# EAGLE schematic Microcell 1.4 (EAGLE 9.4.2)

## Sheet 1 of 5: PTH
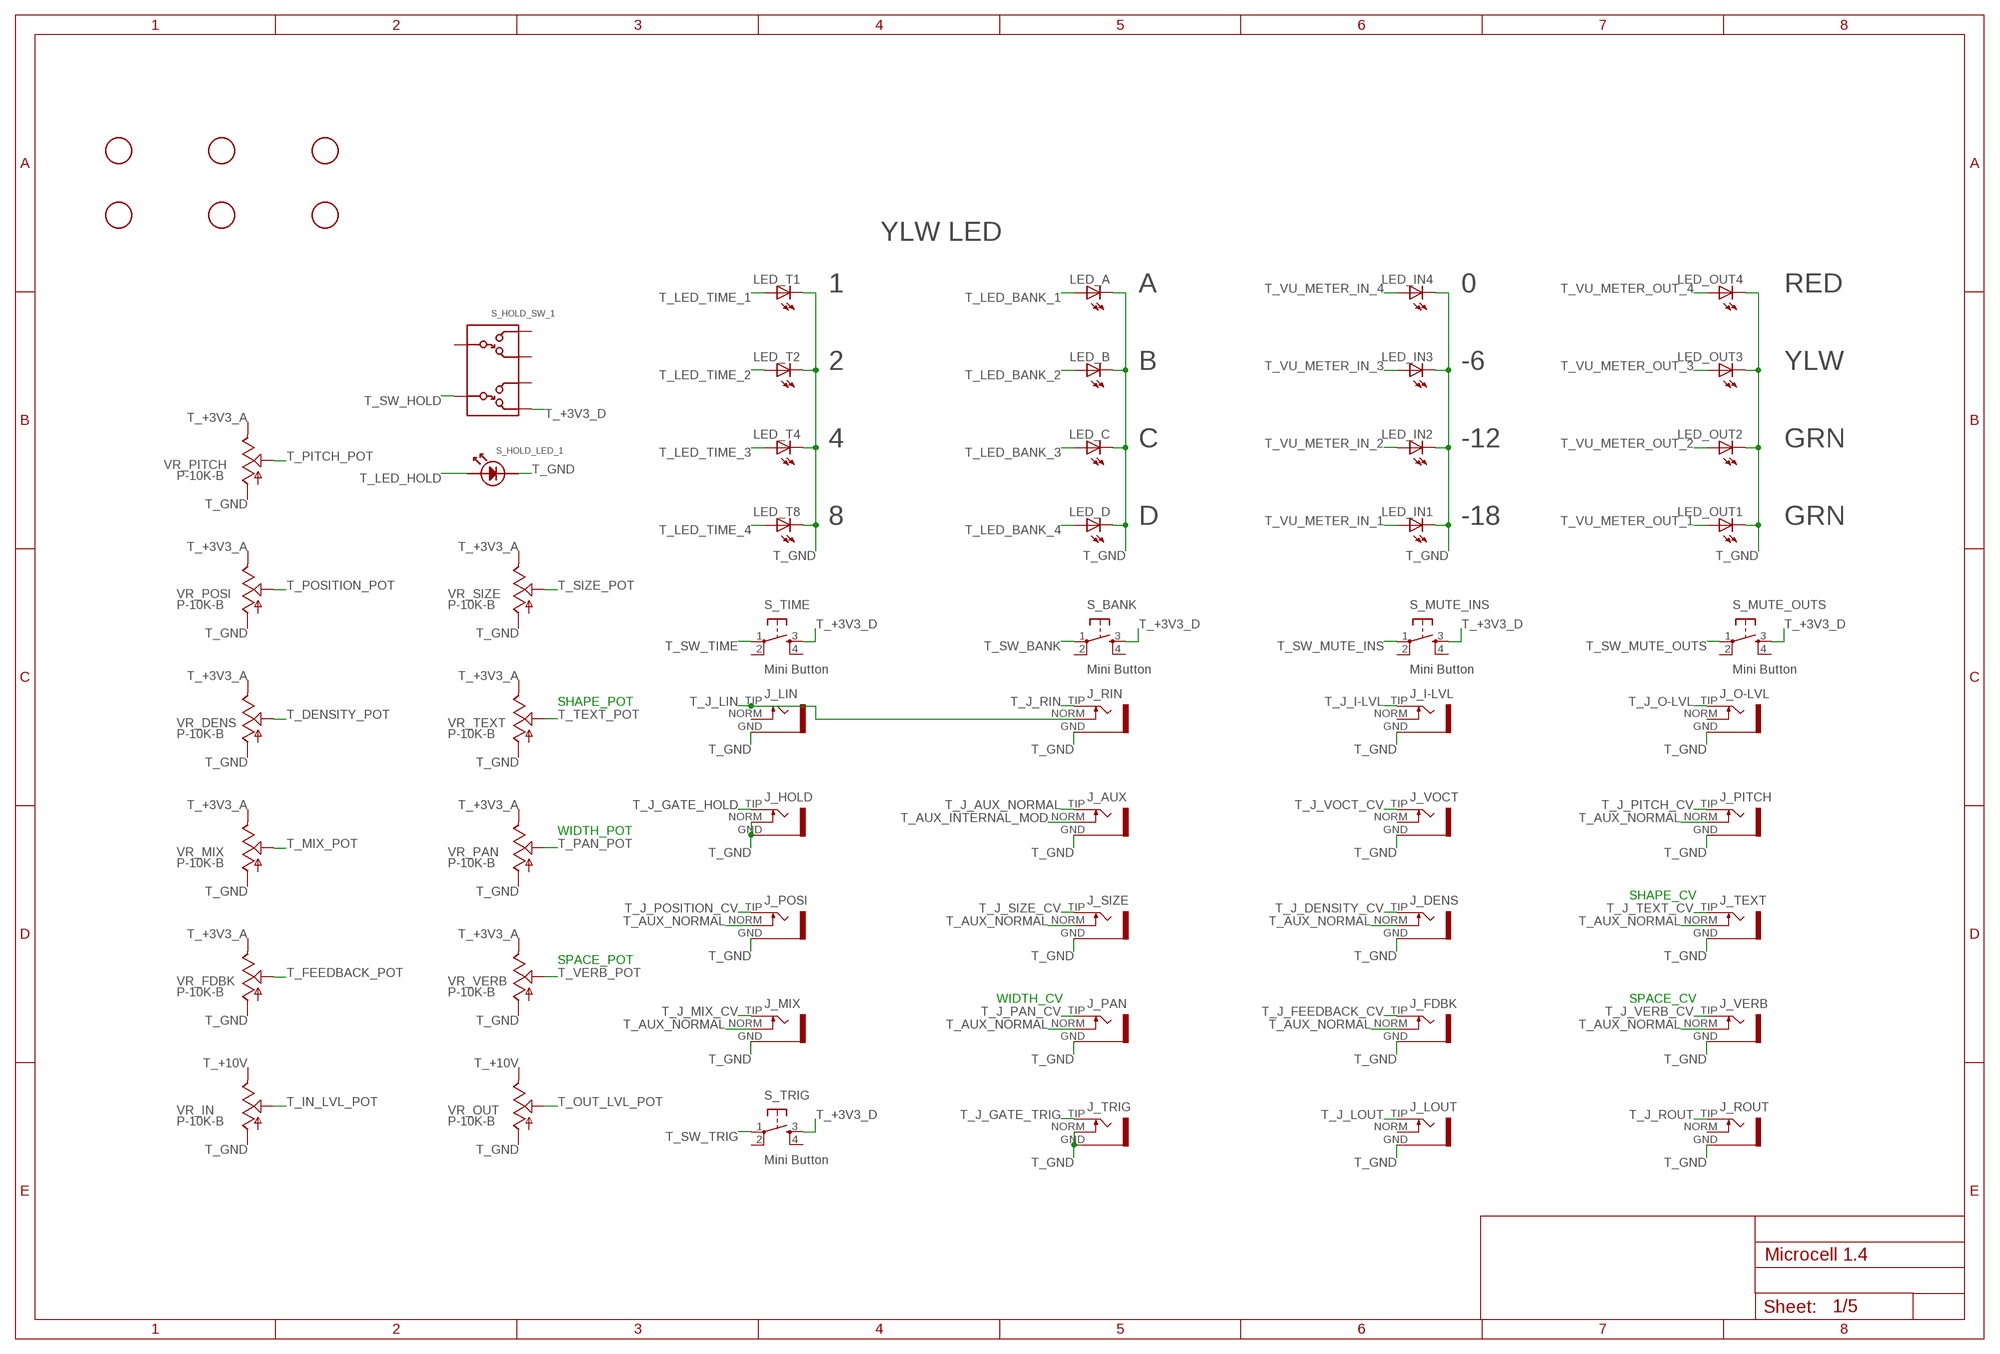
[diagram p0: schematic, sheet 1]

### Parts
FD1  FIDUCIAL  [FIDUCIAL_1MM]
FD2  FIDUCIAL  [FIDUCIAL_1MM]
FD3  FIDUCIAL  [FIDUCIAL_1MM]
FD4  FIDUCIAL  [FIDUCIAL_1MM]
FD5  FIDUCIAL  [FIDUCIAL_1MM]
FD6  FIDUCIAL  [FIDUCIAL_1MM]
J_AUX  Eurorack Jack  EURO_JACKS_SMALL_SILK  [S_JACK_SMALL_SILK]
J_DENS  Eurorack Jack  EURO_JACKS_SILK  [S_JACK_SILK]
J_FDBK  Eurorack Jack  EURO_JACKS_SILK  [S_JACK_SILK]
J_HOLD  Eurorack Jack  EURO_JACKS_SMALL_SILK  [S_JACK_SMALL_SILK]
J_I-LVL  Eurorack Jack  EURO_JACKS_SILK  [S_JACK_SILK]
J_LIN  Eurorack Jack  EURO_JACKS_SILK  [S_JACK_SILK]
J_LOUT  Eurorack Jack  EURO_JACKS_SILK  [S_JACK_SILK]
J_MIX  Eurorack Jack  EURO_JACKS_SILK  [S_JACK_SILK]
J_O-LVL  Eurorack Jack  EURO_JACKS_SILK  [S_JACK_SILK]
J_PAN  Eurorack Jack  EURO_JACKS_SILK  [S_JACK_SILK]
J_PITCH  Eurorack Jack  EURO_JACKS_SILK  [S_JACK_SILK]
J_POSI  Eurorack Jack  EURO_JACKS_SILK  [S_JACK_SILK]
J_RIN  Eurorack Jack  EURO_JACKS_SILK  [S_JACK_SILK]
J_ROUT  Eurorack Jack  EURO_JACKS_SILK  [S_JACK_SILK]
J_SIZE  Eurorack Jack  EURO_JACKS_SILK  [S_JACK_SILK]
J_TEXT  Eurorack Jack  EURO_JACKS_SILK  [S_JACK_SILK]
J_TRIG  Eurorack Jack  EURO_JACKS_SMALL_SILK  [S_JACK_SMALL_SILK]
J_VERB  Eurorack Jack  EURO_JACKS_SILK  [S_JACK_SILK]
J_VOCT  Eurorack Jack  EURO_JACKS_SILK  [S_JACK_SILK]
LED_A  3mm Yellow Diffused  LED_SILK  [LED_SILK]
LED_B  3mm Yellow Diffused  LED_SILK  [LED_SILK]
LED_C  3mm Yellow Diffused  LED_SILK  [LED_SILK]
LED_D  3mm Yellow Diffused  LED_SILK  [LED_SILK]
LED_IN1  3mm Green Diffused  LED_SILK  [LED_SILK]
LED_IN2  3mm Green Diffused  LED_SILK  [LED_SILK]
LED_IN3  3mm Yellow Diffused  LED_SILK  [LED_SILK]
LED_IN4  3mm Red Diffused  LED_SILK  [LED_SILK]
LED_OUT1  3mm Green Diffused  LED_SILK  [LED_SILK]
LED_OUT2  3mm Green Diffused  LED_SILK  [LED_SILK]
LED_OUT3  3mm Yellow Diffused  LED_SILK  [LED_SILK]
LED_OUT4  3mm Red Diffused  LED_SILK  [LED_SILK]
LED_T1  3mm Yellow Diffused  LED_SILK  [LED_SILK]
LED_T2  3mm Yellow Diffused  LED_SILK  [LED_SILK]
LED_T4  3mm Yellow Diffused  LED_SILK  [LED_SILK]
LED_T8  3mm Yellow Diffused  LED_SILK  [LED_SILK]
S_BANK  Mini Button  TAC_SWITCHTACTILE_PTH_SILK  [TACTILE-PTH_SILK]
S_HOLD  LED Button White  LED_BUTTONLED_BUTTON_SILK  [LED_BUTTON_SILK]
S_MUTE_INS  Mini Button  TAC_SWITCHTACTILE_PTH_SILK  [TACTILE-PTH_SILK]
S_MUTE_OUTS  Mini Button  TAC_SWITCHTACTILE_PTH_SILK  [TACTILE-PTH_SILK]
S_TIME  Mini Button  TAC_SWITCHTACTILE_PTH_SILK  [TACTILE-PTH_SILK]
S_TRIG  Mini Button  TAC_SWITCHTACTILE_PTH_SILK  [TACTILE-PTH_SILK]
VR_DENS  P-10K-B  POT_9MM_SNAP-IN__  [9MM_SNAP-IN_POT_SILK]
VR_FDBK  P-10K-B  POT_9MM_SNAP-IN__  [9MM_SNAP-IN_POT_SILK]
VR_IN  P-10K-B  POT_9MM_SNAP-IN__  [9MM_SNAP-IN_POT_SILK]
VR_MIX  P-10K-B  POT_9MM_SNAP-IN__  [9MM_SNAP-IN_POT_SILK]
VR_OUT  P-10K-B  POT_9MM_SNAP-IN__  [9MM_SNAP-IN_POT_SILK]
VR_PAN  P-10K-B  POT_9MM_SNAP-IN__  [9MM_SNAP-IN_POT_SILK]
VR_PITCH  P-10K-B  POT_9MM_SNAP-IN__  [9MM_SNAP-IN_POT_SILK]
VR_POSI  P-10K-B  POT_9MM_SNAP-IN__  [9MM_SNAP-IN_POT_SILK]
VR_SIZE  P-10K-B  POT_9MM_SNAP-IN__  [9MM_SNAP-IN_POT_SILK]
VR_TEXT  P-10K-B  POT_9MM_SNAP-IN__  [9MM_SNAP-IN_POT_SILK]
VR_VERB  P-10K-B  POT_9MM_SNAP-IN__  [9MM_SNAP-IN_POT_SILK]

### Nets
T_+3V3_A: VR_DENS.3 VR_FDBK.3 VR_MIX.3 VR_PAN.3 VR_PITCH.3 VR_POSI.3 VR_SIZE.3 VR_TEXT.3 VR_VERB.3 ; also sheet 2
T_+3V3_D: S_BANK.3 S_HOLD.3 S_MUTE_INS.3 S_MUTE_OUTS.3 S_TIME.3 S_TRIG.3 ; also sheet 2
T_+10V: VR_IN.3 VR_OUT.3 ; also sheet 2
T_AUX_INTERNAL_MOD: J_AUX.NORM ; also sheet 2
T_AUX_NORMAL: J_DENS.NORM J_FDBK.NORM J_MIX.NORM J_PAN.NORM J_PITCH.NORM J_POSI.NORM J_SIZE.NORM J_TEXT.NORM J_VERB.NORM ; also sheet 2
T_DENSITY_POT: VR_DENS.2 ; also sheet 2
T_FEEDBACK_POT: VR_FDBK.2 ; also sheet 2
T_GND: J_AUX.GND J_DENS.GND J_FDBK.GND J_HOLD.GND J_HOLD.NORM J_I-LVL.GND J_LIN.GND J_LOUT.GND J_MIX.GND J_O-LVL.GND J_PAN.GND J_PITCH.GND J_POSI.GND J_RIN.GND J_ROUT.GND J_SIZE.GND J_TEXT.GND J_TRIG.GND J_TRIG.NORM J_VERB.GND J_VOCT.GND LED_A.K(C) LED_B.K(C) LED_C.K(C) LED_D.K(C) LED_IN1.K(C) LED_IN2.K(C) LED_IN3.K(C) LED_IN4.K(C) LED_OUT1.K(C) LED_OUT2.K(C) LED_OUT3.K(C) LED_OUT4.K(C) LED_T1.K(C) LED_T2.K(C) LED_T4.K(C) LED_T8.K(C) S_HOLD.LED_K(_LED_1:LED_K) VR_DENS.1 VR_FDBK.1 VR_IN.1 VR_MIX.1 VR_OUT.1 VR_PAN.1 VR_PITCH.1 VR_POSI.1 VR_SIZE.1 VR_TEXT.1 VR_VERB.1 ; also sheet 2
T_IN_LVL_POT: VR_IN.2 ; also sheet 2
T_J_AUX_NORMAL: J_AUX.TIP ; also sheet 2
T_J_DENSITY_CV: J_DENS.TIP ; also sheet 2
T_J_FEEDBACK_CV: J_FDBK.TIP ; also sheet 2
T_J_GATE_HOLD: J_HOLD.TIP ; also sheet 2
T_J_GATE_TRIG: J_TRIG.TIP ; also sheet 2
T_J_I-LVL: J_I-LVL.TIP ; also sheet 2
T_J_LIN: J_LIN.TIP J_RIN.NORM ; also sheet 2
T_J_LOUT: J_LOUT.TIP ; also sheet 2
T_J_MIX_CV: J_MIX.TIP ; also sheet 2
T_J_O-LVL: J_O-LVL.TIP ; also sheet 2
T_J_PAN_CV: J_PAN.TIP ; also sheet 2
T_J_PITCH_CV: J_PITCH.TIP ; also sheet 2
T_J_POSITION_CV: J_POSI.TIP ; also sheet 2
T_J_RIN: J_RIN.TIP ; also sheet 2
T_J_ROUT: J_ROUT.TIP ; also sheet 2
T_J_SIZE_CV: J_SIZE.TIP ; also sheet 2
T_J_TEXT_CV: J_TEXT.TIP ; also sheet 2
T_J_VERB_CV: J_VERB.TIP ; also sheet 2
T_J_VOCT_CV: J_VOCT.TIP ; also sheet 2
T_LED_BANK_1: LED_A.A ; also sheet 2
T_LED_BANK_2: LED_B.A ; also sheet 2
T_LED_BANK_3: LED_C.A ; also sheet 2
T_LED_BANK_4: LED_D.A ; also sheet 2
T_LED_HOLD: S_HOLD.LED_A(_LED_1:LED_A) ; also sheet 2
T_LED_TIME_1: LED_T1.A ; also sheet 2
T_LED_TIME_2: LED_T2.A ; also sheet 2
T_LED_TIME_3: LED_T4.A ; also sheet 2
T_LED_TIME_4: LED_T8.A ; also sheet 2
T_MIX_POT: VR_MIX.2 ; also sheet 2
T_OUT_LVL_POT: VR_OUT.2 ; also sheet 2
T_PAN_POT: VR_PAN.2 ; also sheet 2
T_PITCH_POT: VR_PITCH.2 ; also sheet 2
T_POSITION_POT: VR_POSI.2 ; also sheet 2
T_SIZE_POT: VR_SIZE.2 ; also sheet 2
T_SW_BANK: S_BANK.1 ; also sheet 2
T_SW_HOLD: S_HOLD.2 ; also sheet 2
T_SW_MUTE_INS: S_MUTE_INS.1 ; also sheet 2
T_SW_MUTE_OUTS: S_MUTE_OUTS.1 ; also sheet 2
T_SW_TIME: S_TIME.1 ; also sheet 2
T_SW_TRIG: S_TRIG.1 ; also sheet 2
T_TEXT_POT: VR_TEXT.2 ; also sheet 2
T_VERB_POT: VR_VERB.2 ; also sheet 2
T_VU_METER_IN_1: LED_IN1.A ; also sheet 2
T_VU_METER_IN_2: LED_IN2.A ; also sheet 2
T_VU_METER_IN_3: LED_IN3.A ; also sheet 2
T_VU_METER_IN_4: LED_IN4.A ; also sheet 2
T_VU_METER_OUT_1: LED_OUT1.A ; also sheet 2
T_VU_METER_OUT_2: LED_OUT2.A ; also sheet 2
T_VU_METER_OUT_3: LED_OUT3.A ; also sheet 2
T_VU_METER_OUT_4: LED_OUT4.A ; also sheet 2
Unconnected: J_I-LVL.NORM J_LIN.NORM J_LOUT.NORM J_O-LVL.NORM J_ROUT.NORM J_VOCT.NORM S_BANK.2 S_BANK.4 S_HOLD.1 S_HOLD.4 S_HOLD.5 S_HOLD.6 S_MUTE_INS.2 S_MUTE_INS.4 S_MUTE_OUTS.2 S_MUTE_OUTS.4 S_TIME.2 S_TIME.4 S_TRIG.2 S_TRIG.4

### Notes on the sheet
- YLW LED
- 1 | A | 0 | RED
- 2 | B | -6 | YLW
- 4 | C | -12 | GRN
- 8 | D | -18 | GRN
- SHAPE_POT
- WIDTH_POT
- SHAPE_CV
- SPACE_POT
- WIDTH_CV | SPACE_CV

## Sheet 2 of 5: POWER
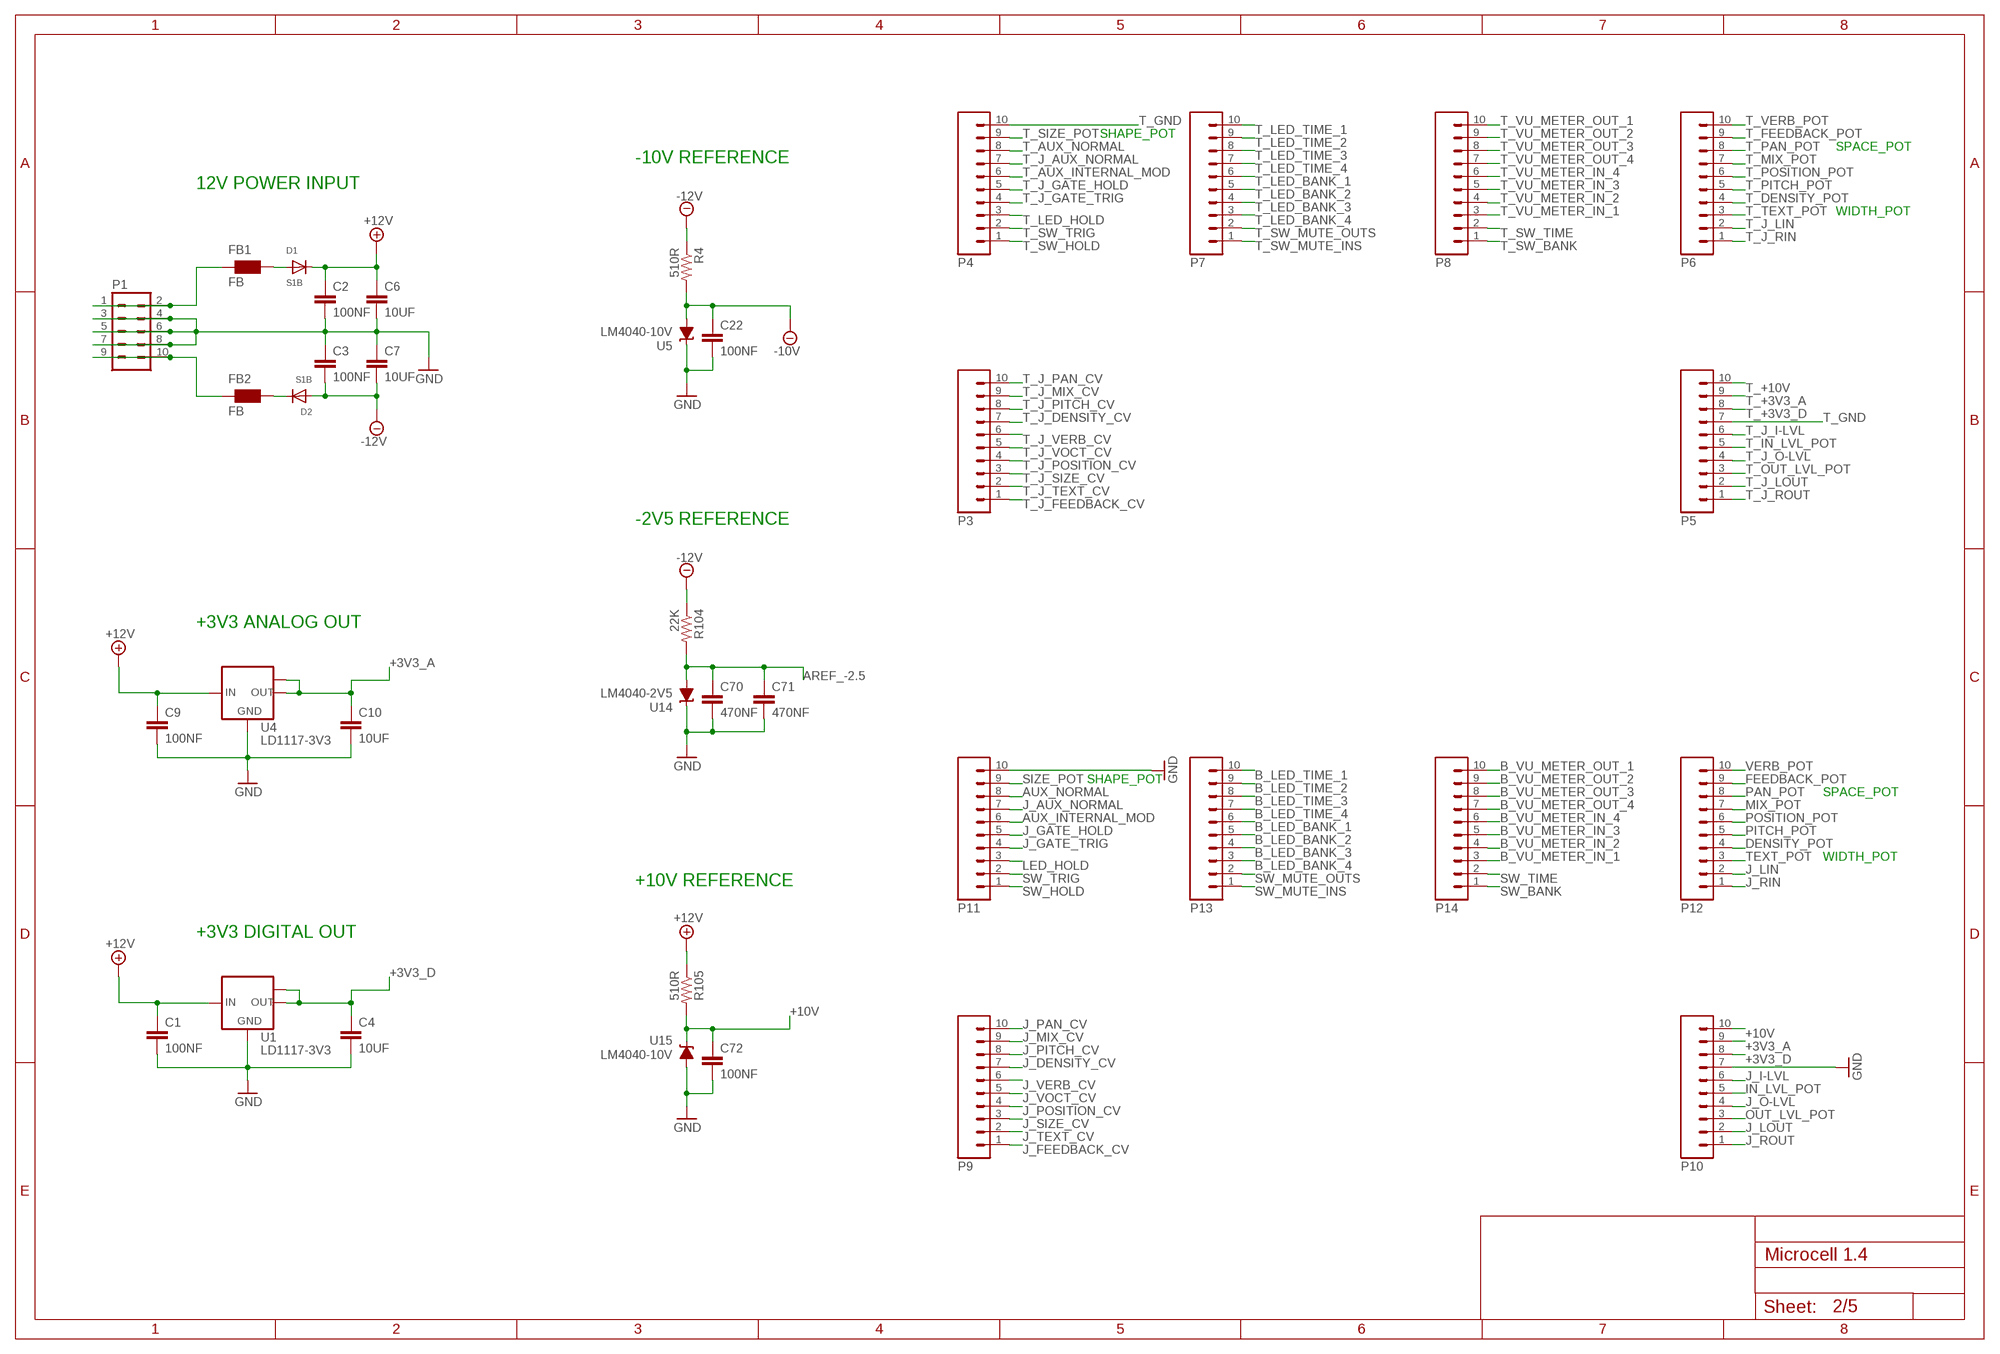
[diagram p1: schematic, sheet 2]

### Parts
C1  100NF  C-EUC0603  [C0603]
C2  100NF  C-EUC0603  [C0603]
C3  100NF  C-EUC0603  [C0603]
C4  10UF  C-EUC0805  [C0805]
C6  10UF  C-EUC0805  [C0805]
C7  10UF  C-EUC0805  [C0805]
C9  100NF  C-EUC0603  [C0603]
C10  10UF  C-EUC0805  [C0805]
C22  100NF  C-EUC0603  [C0603]
C70  470NF  C-EUC0603  [C0603]
C71  470NF  C-EUC0603  [C0603]
C72  100NF  C-EUC0603  [C0603]
D1  S1B  [SMADIODE]
D2  S1B  [SMADIODE]
FB1  FB  FERRITE_BEAD_0603  [WUERTH-ELEKTRONIK_0603]
FB2  FB  FERRITE_BEAD_0603  [WUERTH-ELEKTRONIK_0603]
P1  2X5 Male PTH Header  M05X2_LOCK  [2X5_LOCK]
P3  1X10 Female PTH header  M10_NO_SILK  [1X10_NO_SILK]
P4  1X10 Female PTH header  M10_NO_SILK  [1X10_NO_SILK]
P5  1X10 Female PTH header  M10_NO_SILK  [1X10_NO_SILK]
P6  1X10 Female PTH header  M10_NO_SILK  [1X10_NO_SILK]
P7  1X10 Female PTH header  M10_NO_SILK  [1X10_NO_SILK]
P8  1X10 Female PTH header  M10_NO_SILK  [1X10_NO_SILK]
P9  1X10 Male PTH header  M10_NO_SILK  [1X10_NO_SILK]
P10  1X10 Male PTH header  M10_NO_SILK  [1X10_NO_SILK]
P11  1X10 Male PTH header  M10_NO_SILK  [1X10_NO_SILK]
P12  1X10 Male PTH header  M10_NO_SILK  [1X10_NO_SILK]
P13  1X10 Male PTH header  M10_NO_SILK  [1X10_NO_SILK]
P14  1X10 Male PTH header  M10_NO_SILK  [1X10_NO_SILK]
R4  510R  R-US_R0603  [R0603]
R104  22K  R-US_R0603  [R0603]
R105  510R  R-US_R0603  [R0603]
U1  LD1117-3V3  [SOT223]
U4  LD1117-3V3  [SOT223]
U5  LM4040-10V  LM4041A12DBZ  [DBZ_R-PDSO-G3]
U14  LM4040-2V5  LM4041A12DBZ  [DBZ_R-PDSO-G3]
U15  LM4040-10V  LM4041A12DBZ  [DBZ_R-PDSO-G3]

### Nets
+3V3_A: C10.1 P10.9 U4.2(OUT) U4.TAB(OUT1) ; also sheet 4,5
+3V3_D: C4.1 P10.8 U1.2(OUT) U1.TAB(OUT1) ; also sheet 4,5
+10V: C72.1 P10.10 R105.2 U15.1(C)
+12V: C1.1 C2.1 C6.1 C9.1 D1.C R105.1 U1.3(IN) U4.3(IN) ; also sheet 3,4
-10V: C22.1 R4.2 U5.2(A) ; also sheet 4
-12V: C3.2 C7.2 D2.A R4.1 R104.1 ; also sheet 3,4
AREF_-2.5: C70.1 C71.1 R104.2 U14.2(A) ; also sheet 3
AUX_INTERNAL_MOD: P11.6 ; also sheet 4
AUX_NORMAL: P11.8 ; also sheet 4
B_LED_BANK_1: P13.6 ; also sheet 5
B_LED_BANK_2: P13.5 ; also sheet 5
B_LED_BANK_3: P13.4 ; also sheet 5
B_LED_BANK_4: P13.3 ; also sheet 5
B_LED_TIME_1: P13.10 ; also sheet 5
B_LED_TIME_2: P13.9 ; also sheet 5
B_LED_TIME_3: P13.8 ; also sheet 5
B_LED_TIME_4: P13.7 ; also sheet 5
B_VU_METER_IN_1: P14.3 ; also sheet 5
B_VU_METER_IN_2: P14.4 ; also sheet 5
B_VU_METER_IN_3: P14.5 ; also sheet 5
B_VU_METER_IN_4: P14.6 ; also sheet 5
B_VU_METER_OUT_1: P14.10 ; also sheet 5
B_VU_METER_OUT_2: P14.9 ; also sheet 5
B_VU_METER_OUT_3: P14.8 ; also sheet 5
B_VU_METER_OUT_4: P14.7 ; also sheet 5
DENSITY_POT: P12.4 ; also sheet 5
FEEDBACK_POT: P12.9 ; also sheet 5
GND: C1.2 C2.2 C3.1 C4.2 C6.2 C7.1 C9.2 C10.2 C22.2 C70.2 C71.2 C72.2 P1.3 P1.4 P1.5 P1.6 P1.7 P1.8 P10.7 P11.10 U1.1(GND) U4.1(GND) U5.1(C) U14.1(C) U15.2(A) ; also sheet 3,4,5
IN_LVL_POT: P10.5 ; also sheet 3
J_AUX_NORMAL: P11.7 ; also sheet 4
J_DENSITY_CV: P9.7 ; also sheet 4
J_FEEDBACK_CV: P9.1 ; also sheet 4
J_GATE_HOLD: P11.5 ; also sheet 4
J_GATE_TRIG: P11.4 ; also sheet 4
J_I-LVL: P10.6 ; also sheet 3
J_LIN: P12.2 ; also sheet 3
J_LOUT: P10.2 ; also sheet 3
J_MIX_CV: P9.9 ; also sheet 4
J_O-LVL: P10.4 ; also sheet 3
J_PAN_CV: P9.10 ; also sheet 4
J_PITCH_CV: P9.8 ; also sheet 4
J_POSITION_CV: P9.4 ; also sheet 4
J_RIN: P12.1 ; also sheet 3
J_ROUT: P10.1 ; also sheet 3
J_SIZE_CV: P9.3 ; also sheet 4
J_TEXT_CV: P9.2 ; also sheet 4
J_VERB_CV: P9.6 ; also sheet 4
J_VOCT_CV: P9.5 ; also sheet 4
LED_HOLD: P11.3 ; also sheet 5
MIX_POT: P12.7 ; also sheet 5
N$1: D1.A FB1.2
N$2: FB1.1 P1.1 P1.2
N$3: D2.C FB2.2
N$6: FB2.1 P1.9 P1.10
OUT_LVL_POT: P10.3 ; also sheet 3
PAN_POT: P12.8 ; also sheet 5
PITCH_POT: P12.5 ; also sheet 5
POSITION_POT: P12.6 ; also sheet 5
SIZE_POT: P11.9 ; also sheet 5
SW_BANK: P14.1 ; also sheet 5
SW_HOLD: P11.1 ; also sheet 5
SW_MUTE_INS: P13.1 ; also sheet 5
SW_MUTE_OUTS: P13.2 ; also sheet 5
SW_TIME: P14.2 ; also sheet 5
SW_TRIG: P11.2 ; also sheet 5
T_+3V3_A: P5.9 ; also sheet 1
T_+3V3_D: P5.8 ; also sheet 1
T_+10V: P5.10 ; also sheet 1
T_AUX_INTERNAL_MOD: P4.6 ; also sheet 1
T_AUX_NORMAL: P4.8 ; also sheet 1
T_DENSITY_POT: P6.4 ; also sheet 1
T_FEEDBACK_POT: P6.9 ; also sheet 1
T_GND: P4.10 P5.7 ; also sheet 1
T_IN_LVL_POT: P5.5 ; also sheet 1
T_J_AUX_NORMAL: P4.7 ; also sheet 1
T_J_DENSITY_CV: P3.7 ; also sheet 1
T_J_FEEDBACK_CV: P3.1 ; also sheet 1
T_J_GATE_HOLD: P4.5 ; also sheet 1
T_J_GATE_TRIG: P4.4 ; also sheet 1
T_J_I-LVL: P5.6 ; also sheet 1
T_J_LIN: P6.2 ; also sheet 1
T_J_LOUT: P5.2 ; also sheet 1
T_J_MIX_CV: P3.9 ; also sheet 1
T_J_O-LVL: P5.4 ; also sheet 1
T_J_PAN_CV: P3.10 ; also sheet 1
T_J_PITCH_CV: P3.8 ; also sheet 1
T_J_POSITION_CV: P3.4 ; also sheet 1
T_J_RIN: P6.1 ; also sheet 1
T_J_ROUT: P5.1 ; also sheet 1
T_J_SIZE_CV: P3.3 ; also sheet 1
T_J_TEXT_CV: P3.2 ; also sheet 1
T_J_VERB_CV: P3.6 ; also sheet 1
T_J_VOCT_CV: P3.5 ; also sheet 1
T_LED_BANK_1: P7.6 ; also sheet 1
T_LED_BANK_2: P7.5 ; also sheet 1
T_LED_BANK_3: P7.4 ; also sheet 1
T_LED_BANK_4: P7.3 ; also sheet 1
T_LED_HOLD: P4.3 ; also sheet 1
T_LED_TIME_1: P7.10 ; also sheet 1
T_LED_TIME_2: P7.9 ; also sheet 1
T_LED_TIME_3: P7.8 ; also sheet 1
T_LED_TIME_4: P7.7 ; also sheet 1
T_MIX_POT: P6.7 ; also sheet 1
T_OUT_LVL_POT: P5.3 ; also sheet 1
T_PAN_POT: P6.8 ; also sheet 1
T_PITCH_POT: P6.5 ; also sheet 1
T_POSITION_POT: P6.6 ; also sheet 1
T_SIZE_POT: P4.9 ; also sheet 1
T_SW_BANK: P8.1 ; also sheet 1
T_SW_HOLD: P4.1 ; also sheet 1
T_SW_MUTE_INS: P7.1 ; also sheet 1
T_SW_MUTE_OUTS: P7.2 ; also sheet 1
T_SW_TIME: P8.2 ; also sheet 1
T_SW_TRIG: P4.2 ; also sheet 1
T_TEXT_POT: P6.3 ; also sheet 1
T_VERB_POT: P6.10 ; also sheet 1
T_VU_METER_IN_1: P8.3 ; also sheet 1
T_VU_METER_IN_2: P8.4 ; also sheet 1
T_VU_METER_IN_3: P8.5 ; also sheet 1
T_VU_METER_IN_4: P8.6 ; also sheet 1
T_VU_METER_OUT_1: P8.10 ; also sheet 1
T_VU_METER_OUT_2: P8.9 ; also sheet 1
T_VU_METER_OUT_3: P8.8 ; also sheet 1
T_VU_METER_OUT_4: P8.7 ; also sheet 1
TEXT_POT: P12.3 ; also sheet 5
VERB_POT: P12.10 ; also sheet 5

### Notes on the sheet
- SHAPE_POT
- SPACE_POT
- -10V REFERENCE
- 12V POWER INPUT
- WIDTH_POT
- -2V5 REFERENCE
- +3V3 ANALOG OUT
- SHAPE_POT
- SPACE_POT
- WIDTH_POT
- +10V REFERENCE
- +3V3 DIGITAL OUT

## Sheet 3 of 5: AUDIO I/O
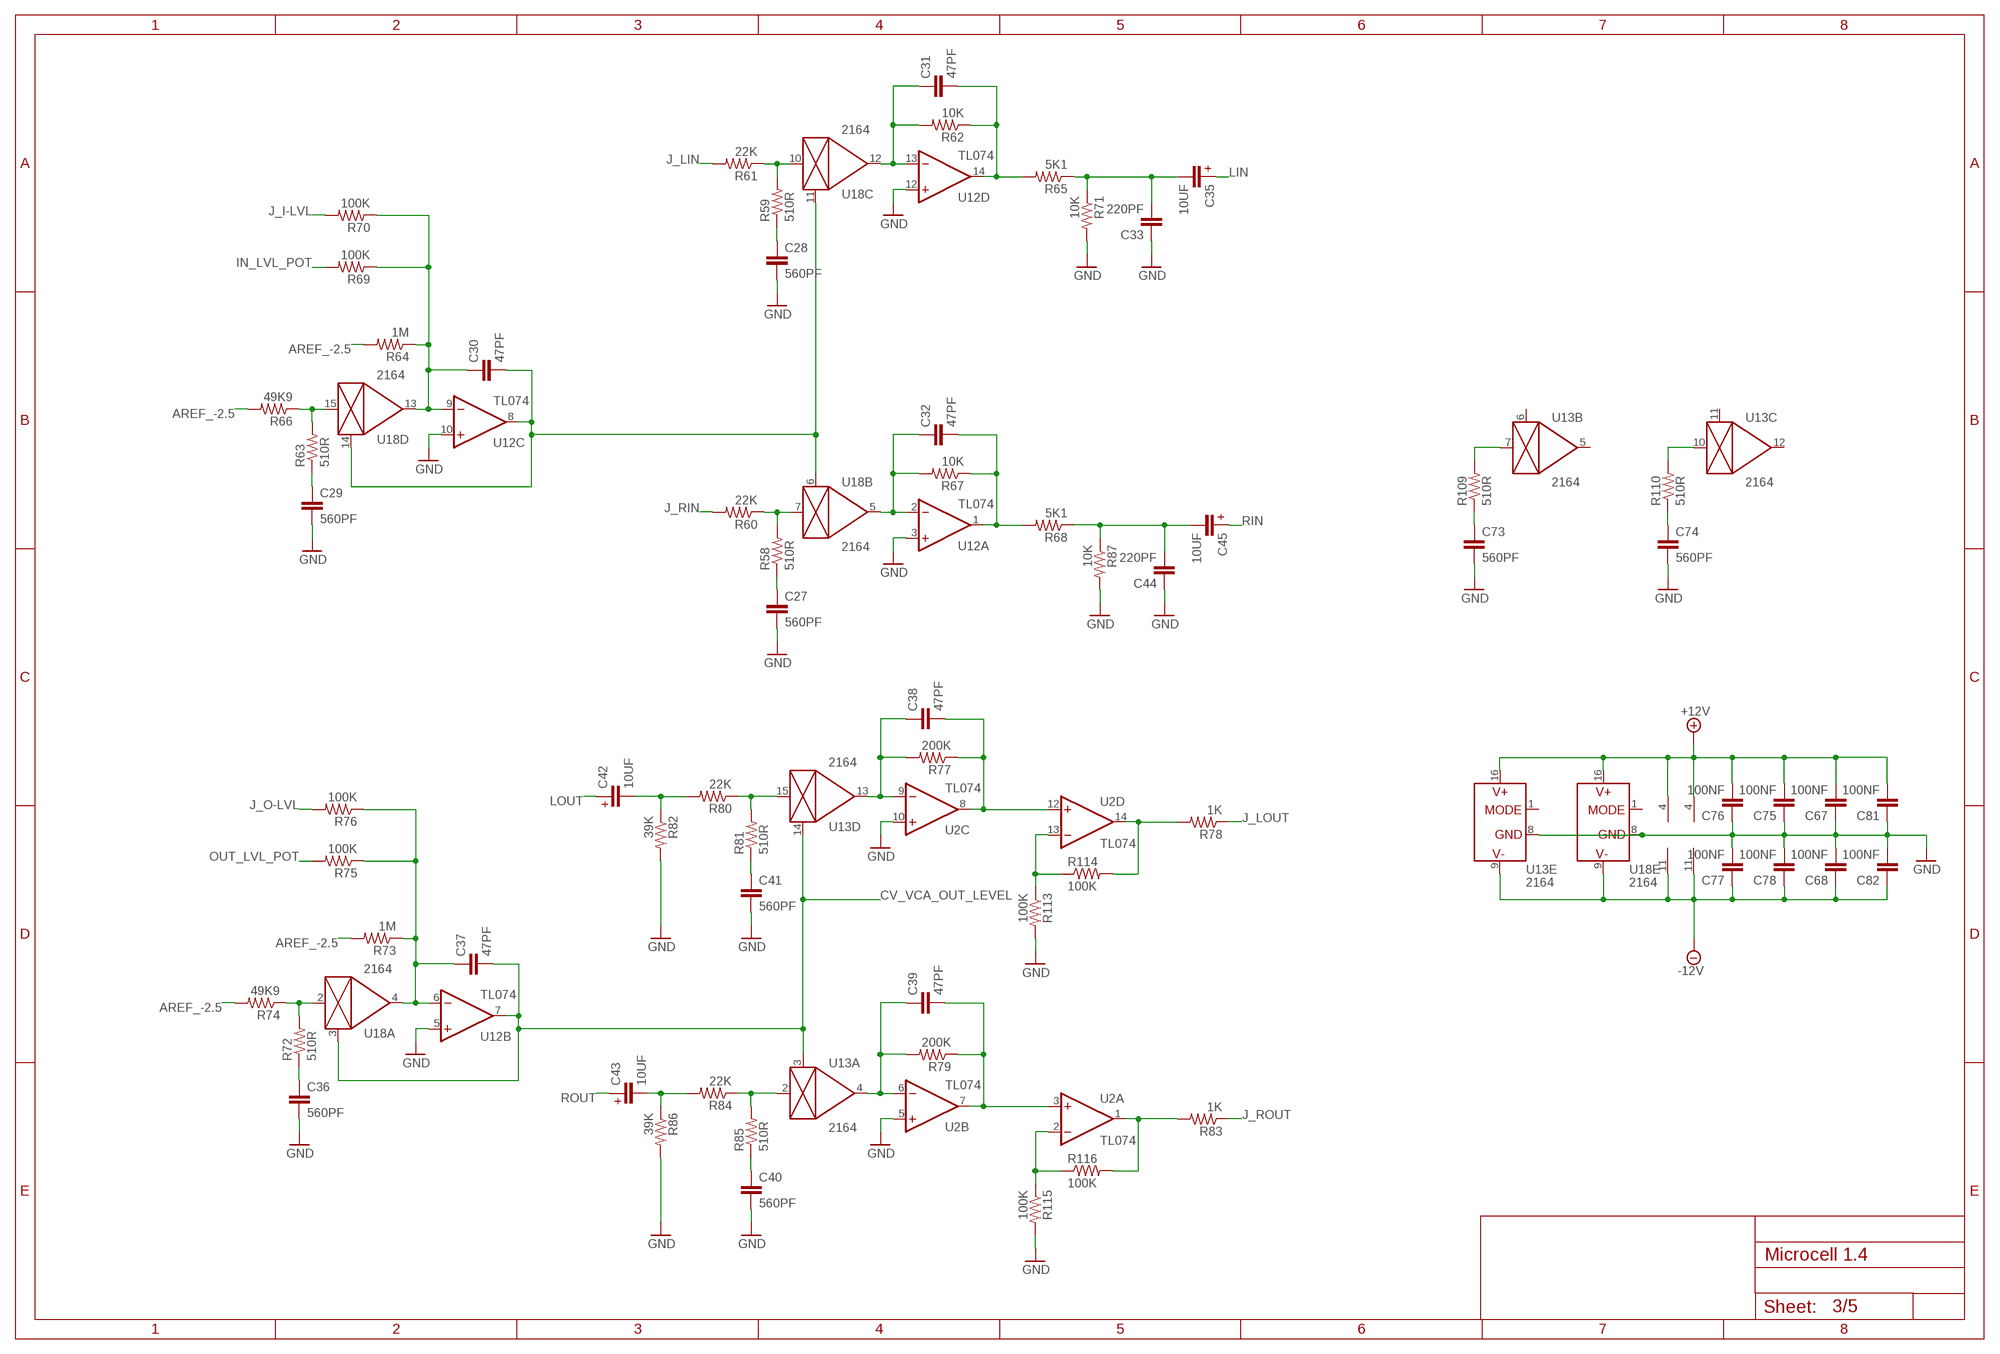
[diagram p2: schematic, sheet 3]

### Parts
C27  560PF  C-EUC0603  [C0603]
C28  560PF  C-EUC0603  [C0603]
C29  560PF  C-EUC0603  [C0603]
C30  47PF  C-EUC0603  [C0603]
C31  47PF  C-EUC0603  [C0603]
C32  47PF  C-EUC0603  [C0603]
C33  220PF  C-EUC0603  [C0603]
C35  10UF  C-EU-POL_4D  [EC-4X7]
C36  560PF  C-EUC0603  [C0603]
C37  47PF  C-EUC0603  [C0603]
C38  47PF  C-EUC0603  [C0603]
C39  47PF  C-EUC0603  [C0603]
C40  560PF  C-EUC0603  [C0603]
C41  560PF  C-EUC0603  [C0603]
C42  10UF  C-EU-POL_4D  [EC-4X7]
C43  10UF  C-EU-POL_4D  [EC-4X7]
C44  220PF  C-EUC0603  [C0603]
C45  10UF  C-EU-POL_4D  [EC-4X7]
C67  100NF  C-EUC0603  [C0603]
C68  100NF  C-EUC0603  [C0603]
C73  560PF  C-EUC0603  [C0603]
C74  560PF  C-EUC0603  [C0603]
C75  100NF  C-EUC0603  [C0603]
C76  100NF  C-EUC0603  [C0603]
C77  100NF  C-EUC0603  [C0603]
C78  100NF  C-EUC0603  [C0603]
C81  100NF  C-EUC0603  [C0603]
C82  100NF  C-EUC0603  [C0603]
R58  510R  R-US_R0603  [R0603]
R59  510R  R-US_R0603  [R0603]
R60  22K  R-US_R0603  [R0603]
R61  22K  R-US_R0603  [R0603]
R62  10K  R-US_R0603  [R0603]
R63  510R  R-US_R0603  [R0603]
R64  1M  R-US_R0603  [R0603]
R65  5K1  R-US_R0603  [R0603]
R66  49K9  R-US_R0603  [R0603]
R67  10K  R-US_R0603  [R0603]
R68  5K1  R-US_R0603  [R0603]
R69  100K  R-US_R0603  [R0603]
R70  100K  R-US_R0603  [R0603]
R71  10K  R-US_R0603  [R0603]
R72  510R  R-US_R0603  [R0603]
R73  1M  R-US_R0603  [R0603]
R74  49K9  R-US_R0603  [R0603]
R75  100K  R-US_R0603  [R0603]
R76  100K  R-US_R0603  [R0603]
R77  200K  R-US_R0603  [R0603]
R78  1K  R-US_R0603  [R0603]
R79  200K  R-US_R0603  [R0603]
R80  22K  R-US_R0603  [R0603]
R81  510R  R-US_R0603  [R0603]
R82  39K  R-US_R0603  [R0603]
R83  1K  R-US_R0603  [R0603]
R84  22K  R-US_R0603  [R0603]
R85  510R  R-US_R0603  [R0603]
R86  39K  R-US_R0603  [R0603]
R87  10K  R-US_R0603  [R0603]
R109  510R  R-US_R0603  [R0603]
R110  510R  R-US_R0603  [R0603]
R113  100K  R-US_R0603  [R0603]
R114  100K  R-US_R0603  [R0603]
R115  100K  R-US_R0603  [R0603]
R116  100K  R-US_R0603  [R0603]
U2  TL074  TL074_SO-14  [SO-14]
U12  TL074  TL074_SO-14  [SO-14]
U13  2164  SSI2164  [SO-16]
U18  2164  SSI2164  [SO-16]

### Nets
+12V: C67.2 C75.2 C76.2 C81.2 U2.4(P:V+) U12.4(P:V+) U13.16(E:V+) U18.16(E:V+) ; also sheet 2,4
-12V: C68.1 C77.1 C78.1 C82.1 U2.11(P:V-) U12.11(P:V-) U13.9(E:V-) U18.9(E:V-) ; also sheet 2,4
AREF_-2.5: R64.2 R66.2 R73.2 R74.2 ; also sheet 2
CV_VCA_OUT_LEVEL: C37.2 U12.7(B:OUT) U13.3(A:CTRL) U13.14(D:CTRL) U18.3(A:CTRL) ; also sheet 5
GND: C27.2 C28.2 C29.2 C33.1 C36.2 C40.2 C41.2 C44.1 C67.1 C68.2 C73.2 C74.2 C75.1 C76.1 C77.2 C78.2 C81.1 C82.2 R71.2 R82.2 R86.2 R87.2 R113.2 R115.2 U2.5(B:+IN) U2.10(C:+IN) U12.3(A:+IN) U12.5(B:+IN) U12.10(C:+IN) U12.12(D:+IN) U13.8(E:GND) U18.8(E:GND) ; also sheet 2,4,5
IN_LVL_POT: R69.2 ; also sheet 2
J_I-LVL: R70.2 ; also sheet 2
J_LIN: R61.2 ; also sheet 2
J_LOUT: R78.1 ; also sheet 2
J_O-LVL: R76.2 ; also sheet 2
J_RIN: R60.2 ; also sheet 2
J_ROUT: R83.1 ; also sheet 2
LIN: C35.P$1(POS) ; also sheet 5
LOUT: C42.P$1(POS) ; also sheet 5
N$50: C28.1 R59.1
N$51: C27.1 R58.1
N$54: C29.1 R63.1
N$55: C30.2 U12.8(C:OUT) U18.6(B:CTRL) U18.11(C:CTRL) U18.14(D:CTRL)
N$56: R58.2 R60.1 U18.7(B:IN)
N$57: R63.2 R66.1 U18.15(D:IN)
N$58: C32.1 R67.2 U12.2(A:-IN) U18.5(B:OUT)
N$61: C32.2 R67.1 R68.2 U12.1(A:OUT)
N$67: C36.1 R72.1
N$70: R72.2 R74.1 U18.2(A:IN)
N$73: C38.1 R77.2 U2.9(C:-IN) U13.13(D:OUT)
N$74: C38.2 R77.1 U2.8(C:OUT) U2.12(D:+IN)
N$75: R59.2 R61.1 U18.10(C:IN)
N$76: R109.2 U13.7(B:IN)
N$78: R80.1 R81.2 U13.15(D:IN)
N$79: C41.1 R81.1
N$80: C42.P$2(NEG) R80.2 R82.1
N$83: C44.2 C45.P$2(NEG) R68.1 R87.1
N$86: C39.1 R79.2 U2.6(B:-IN) U13.4(A:OUT)
N$87: C39.2 R79.1 U2.3(A:+IN) U2.7(B:OUT)
N$89: R84.1 R85.2 U13.2(A:IN)
N$90: C40.1 R85.1
N$91: C43.P$2(NEG) R84.2 R86.1
N$92: R110.2 U13.10(C:IN)
N$96: C31.1 R62.2 U12.13(D:-IN) U18.12(C:OUT)
N$100: C31.2 R62.1 R65.2 U12.14(D:OUT)
N$115: R113.1 R114.1 U2.13(D:-IN)
N$117: C73.1 R109.1
N$118: C74.1 R110.1
N$119: R78.2 R114.2 U2.14(D:OUT)
N$120: R115.1 R116.1 U2.2(A:-IN)
N$121: R83.2 R116.2 U2.1(A:OUT)
N$125: C33.2 C35.P$2(NEG) R65.1 R71.1
OUT_LVL_POT: R75.2 ; also sheet 2
RIN: C45.P$1(POS) ; also sheet 5
ROUT: C43.P$1(POS) ; also sheet 5
VCA_CTRL_INPUTS: C30.1 R64.1 R69.1 R70.1 U12.9(C:-IN) U18.13(D:OUT)
VCA_CTRL_INPUTS1: C37.1 R73.1 R75.1 R76.1 U12.6(B:-IN) U18.4(A:OUT)
Unconnected: U13.1(E:MODE) U13.5(B:OUT) U13.6(B:CTRL) U13.11(C:CTRL) U13.12(C:OUT) U18.1(E:MODE)

## Sheet 4 of 5: AUDIO CV
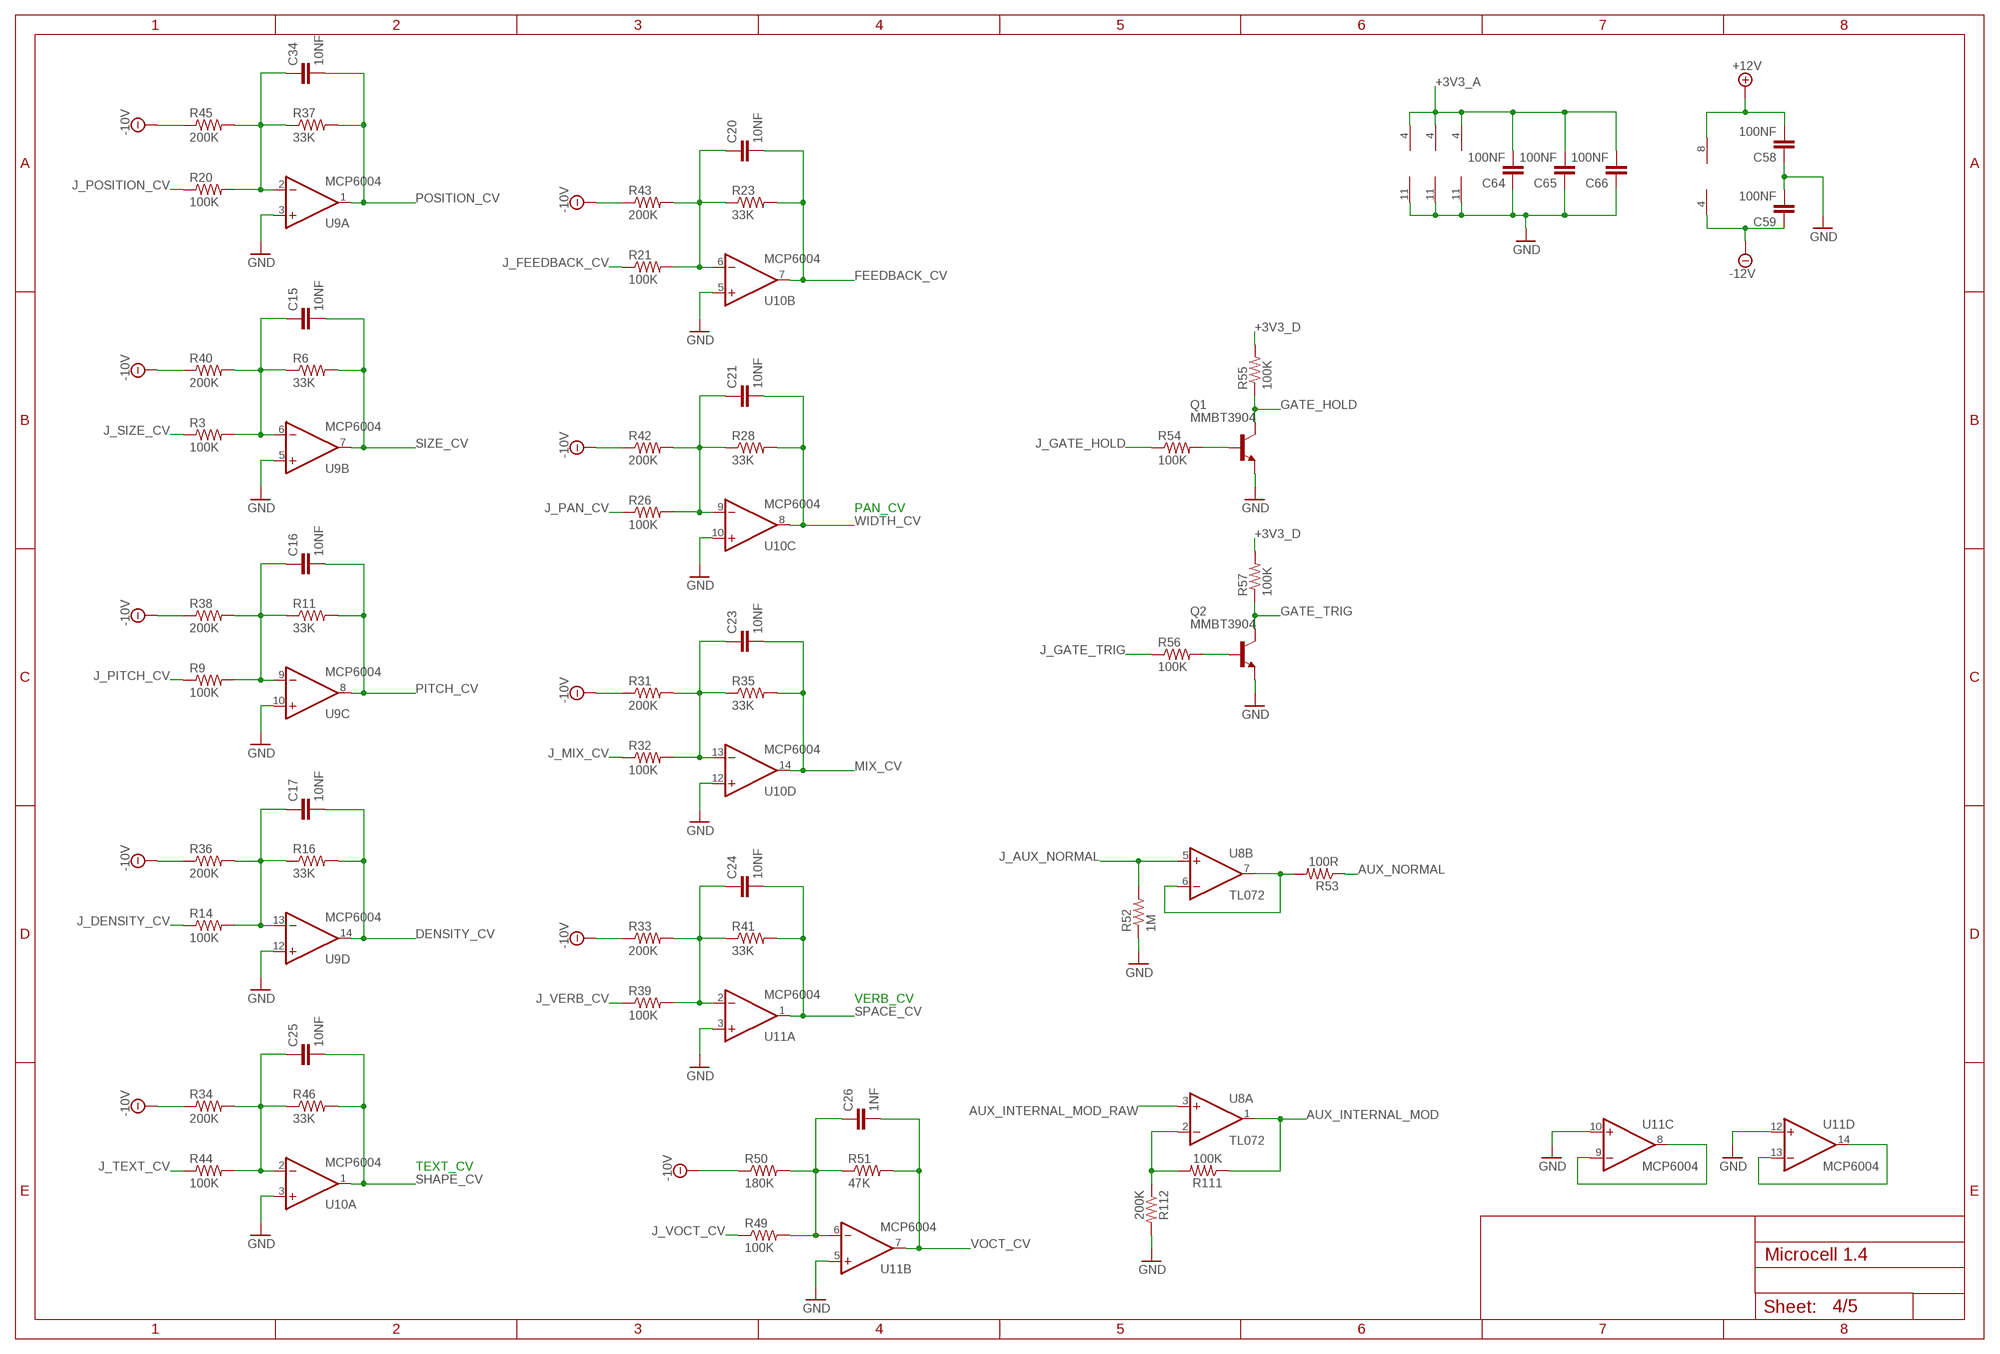
[diagram p3: schematic, sheet 4]

### Parts
C15  10NF  C-EUC0603  [C0603]
C16  10NF  C-EUC0603  [C0603]
C17  10NF  C-EUC0603  [C0603]
C20  10NF  C-EUC0603  [C0603]
C21  10NF  C-EUC0603  [C0603]
C23  10NF  C-EUC0603  [C0603]
C24  10NF  C-EUC0603  [C0603]
C25  10NF  C-EUC0603  [C0603]
C26  1NF  C-EUC0603  [C0603]
C34  10NF  C-EUC0603  [C0603]
C58  100NF  C-EUC0603  [C0603]
C59  100NF  C-EUC0603  [C0603]
C64  100NF  C-EUC0603  [C0603]
C65  100NF  C-EUC0603  [C0603]
C66  100NF  C-EUC0603  [C0603]
Q1  MMBT3904  MMBT3904LT1-NPN-SOT23-BEC  [SOT23-BEC]
Q2  MMBT3904  MMBT3904LT1-NPN-SOT23-BEC  [SOT23-BEC]
R3  100K  R-US_R0603  [R0603]
R6  33K  R-US_R0603  [R0603]
R9  100K  R-US_R0603  [R0603]
R11  33K  R-US_R0603  [R0603]
R14  100K  R-US_R0603  [R0603]
R16  33K  R-US_R0603  [R0603]
R20  100K  R-US_R0603  [R0603]
R21  100K  R-US_R0603  [R0603]
R23  33K  R-US_R0603  [R0603]
R26  100K  R-US_R0603  [R0603]
R28  33K  R-US_R0603  [R0603]
R31  200K  R-US_R0603  [R0603]
R32  100K  R-US_R0603  [R0603]
R33  200K  R-US_R0603  [R0603]
R34  200K  R-US_R0603  [R0603]
R35  33K  R-US_R0603  [R0603]
R36  200K  R-US_R0603  [R0603]
R37  33K  R-US_R0603  [R0603]
R38  200K  R-US_R0603  [R0603]
R39  100K  R-US_R0603  [R0603]
R40  200K  R-US_R0603  [R0603]
R41  33K  R-US_R0603  [R0603]
R42  200K  R-US_R0603  [R0603]
R43  200K  R-US_R0603  [R0603]
R44  100K  R-US_R0603  [R0603]
R45  200K  R-US_R0603  [R0603]
R46  33K  R-US_R0603  [R0603]
R49  100K  R-US_R0603  [R0603]
R50  180K  R-US_R0603  [R0603]
R51  47K  R-US_R0603  [R0603]
R52  1M  R-US_R0603  [R0603]
R53  100R  R-US_R0603  [R0603]
R54  100K  R-US_R0603  [R0603]
R55  100K  R-US_R0603  [R0603]
R56  100K  R-US_R0603  [R0603]
R57  100K  R-US_R0603  [R0603]
R111  100K  R-US_R0603  [R0603]
R112  200K  R-US_R0603  [R0603]
U8  TL072  TL072_SO-8  [SO-8]
U9  MCP6004  MCP6004_SO-14  [SO-14]
U10  MCP6004  MCP6004_SO-14  [SO-14]
U11  MCP6004  MCP6004_SO-14  [SO-14]

### Nets
+3V3_A: C64.2 C65.2 C66.2 U9.4(P:V+) U10.4(P:V+) U11.4(P:V+) ; also sheet 2,5
+3V3_D: R55.2 R57.2 ; also sheet 2,5
+12V: C58.2 U8.8(P:V+) ; also sheet 2,3
-10V: R31.1 R33.1 R34.1 R36.1 R38.1 R40.1 R42.1 R43.1 R45.1 R50.1 ; also sheet 2
-12V: C59.1 U8.4(P:V-) ; also sheet 2,3
AUX_INTERNAL_MOD: R111.1 U8.1(A:OUT) ; also sheet 2
AUX_INTERNAL_MOD_RAW: U8.3(A:+IN) ; also sheet 5
AUX_NORMAL: R53.1 ; also sheet 2
DENSITY_CV: C17.2 R16.2 U9.14(D:OUT) ; also sheet 5
FEEDBACK_CV: C20.2 R23.2 U10.7(B:OUT) ; also sheet 5
GATE_HOLD: Q1.C R55.1 ; also sheet 5
GATE_TRIG: Q2.C R57.1 ; also sheet 5
GND: C58.1 C59.2 C64.1 C65.1 C66.1 Q1.E Q2.E R52.1 R112.2 U9.3(A:+IN) U9.5(B:+IN) U9.10(C:+IN) U9.11(P:V-) U9.12(D:+IN) U10.3(A:+IN) U10.5(B:+IN) U10.10(C:+IN) U10.11(P:V-) U10.12(D:+IN) U11.3(A:+IN) U11.5(B:+IN) U11.10(C:+IN) U11.11(P:V-) U11.12(D:+IN) ; also sheet 2,3,5
J_AUX_NORMAL: R52.2 U8.5(B:+IN) ; also sheet 2
J_DENSITY_CV: R14.1 ; also sheet 2
J_FEEDBACK_CV: R21.1 ; also sheet 2
J_GATE_HOLD: R54.1 ; also sheet 2
J_GATE_TRIG: R56.1 ; also sheet 2
J_MIX_CV: R32.1 ; also sheet 2
J_PAN_CV: R26.1 ; also sheet 2
J_PITCH_CV: R9.1 ; also sheet 2
J_POSITION_CV: R20.1 ; also sheet 2
J_SIZE_CV: R3.1 ; also sheet 2
J_TEXT_CV: R44.1 ; also sheet 2
J_VERB_CV: R39.1 ; also sheet 2
J_VOCT_CV: R49.1 ; also sheet 2
MIX_CV: C23.2 R35.2 U10.14(D:OUT) ; also sheet 5
N$5: C15.1 R3.2 R6.1 R40.2 U9.6(B:-IN)
N$11: C16.1 R9.2 R11.1 R38.2 U9.9(C:-IN)
N$16: C17.1 R14.2 R16.1 R36.2 U9.13(D:-IN)
N$21: C20.1 R21.2 R23.1 R43.2 U10.6(B:-IN)
N$26: C21.1 R26.2 R28.1 R42.2 U10.9(C:-IN)
N$31: C23.1 R31.2 R32.2 R35.1 U10.13(D:-IN)
N$36: C24.1 R33.2 R39.2 R41.1 U11.2(A:-IN)
N$41: C25.1 R34.2 R44.2 R46.1 U10.2(A:-IN)
N$46: R53.2 U8.6(B:-IN) U8.7(B:OUT)
N$47: Q1.B R54.2
N$49: C26.1 R49.2 R50.2 R51.1 U11.6(B:-IN)
N$52: Q2.B R56.2
N$82: C34.1 R20.2 R37.1 R45.2 U9.2(A:-IN)
N$111: U11.8(C:OUT) U11.9(C:-IN)
N$113: U11.13(D:-IN) U11.14(D:OUT)
N$116: R111.2 R112.1 U8.2(A:-IN)
PITCH_CV: C16.2 R11.2 U9.8(C:OUT) ; also sheet 5
POSITION_CV: C34.2 R37.2 U9.1(A:OUT) ; also sheet 5
SHAPE_CV: C25.2 R46.2 U10.1(A:OUT) ; also sheet 5
SIZE_CV: C15.2 R6.2 U9.7(B:OUT) ; also sheet 5
SPACE_CV: C24.2 R41.2 U11.1(A:OUT) ; also sheet 5
VOCT_CV: C26.2 R51.2 U11.7(B:OUT) ; also sheet 5
WIDTH_CV: C21.2 R28.2 U10.8(C:OUT) ; also sheet 5

### Notes on the sheet
- PAN_CV
- VERB_CV
- TEXT_CV

## Sheet 5 of 5: MCU/DAC
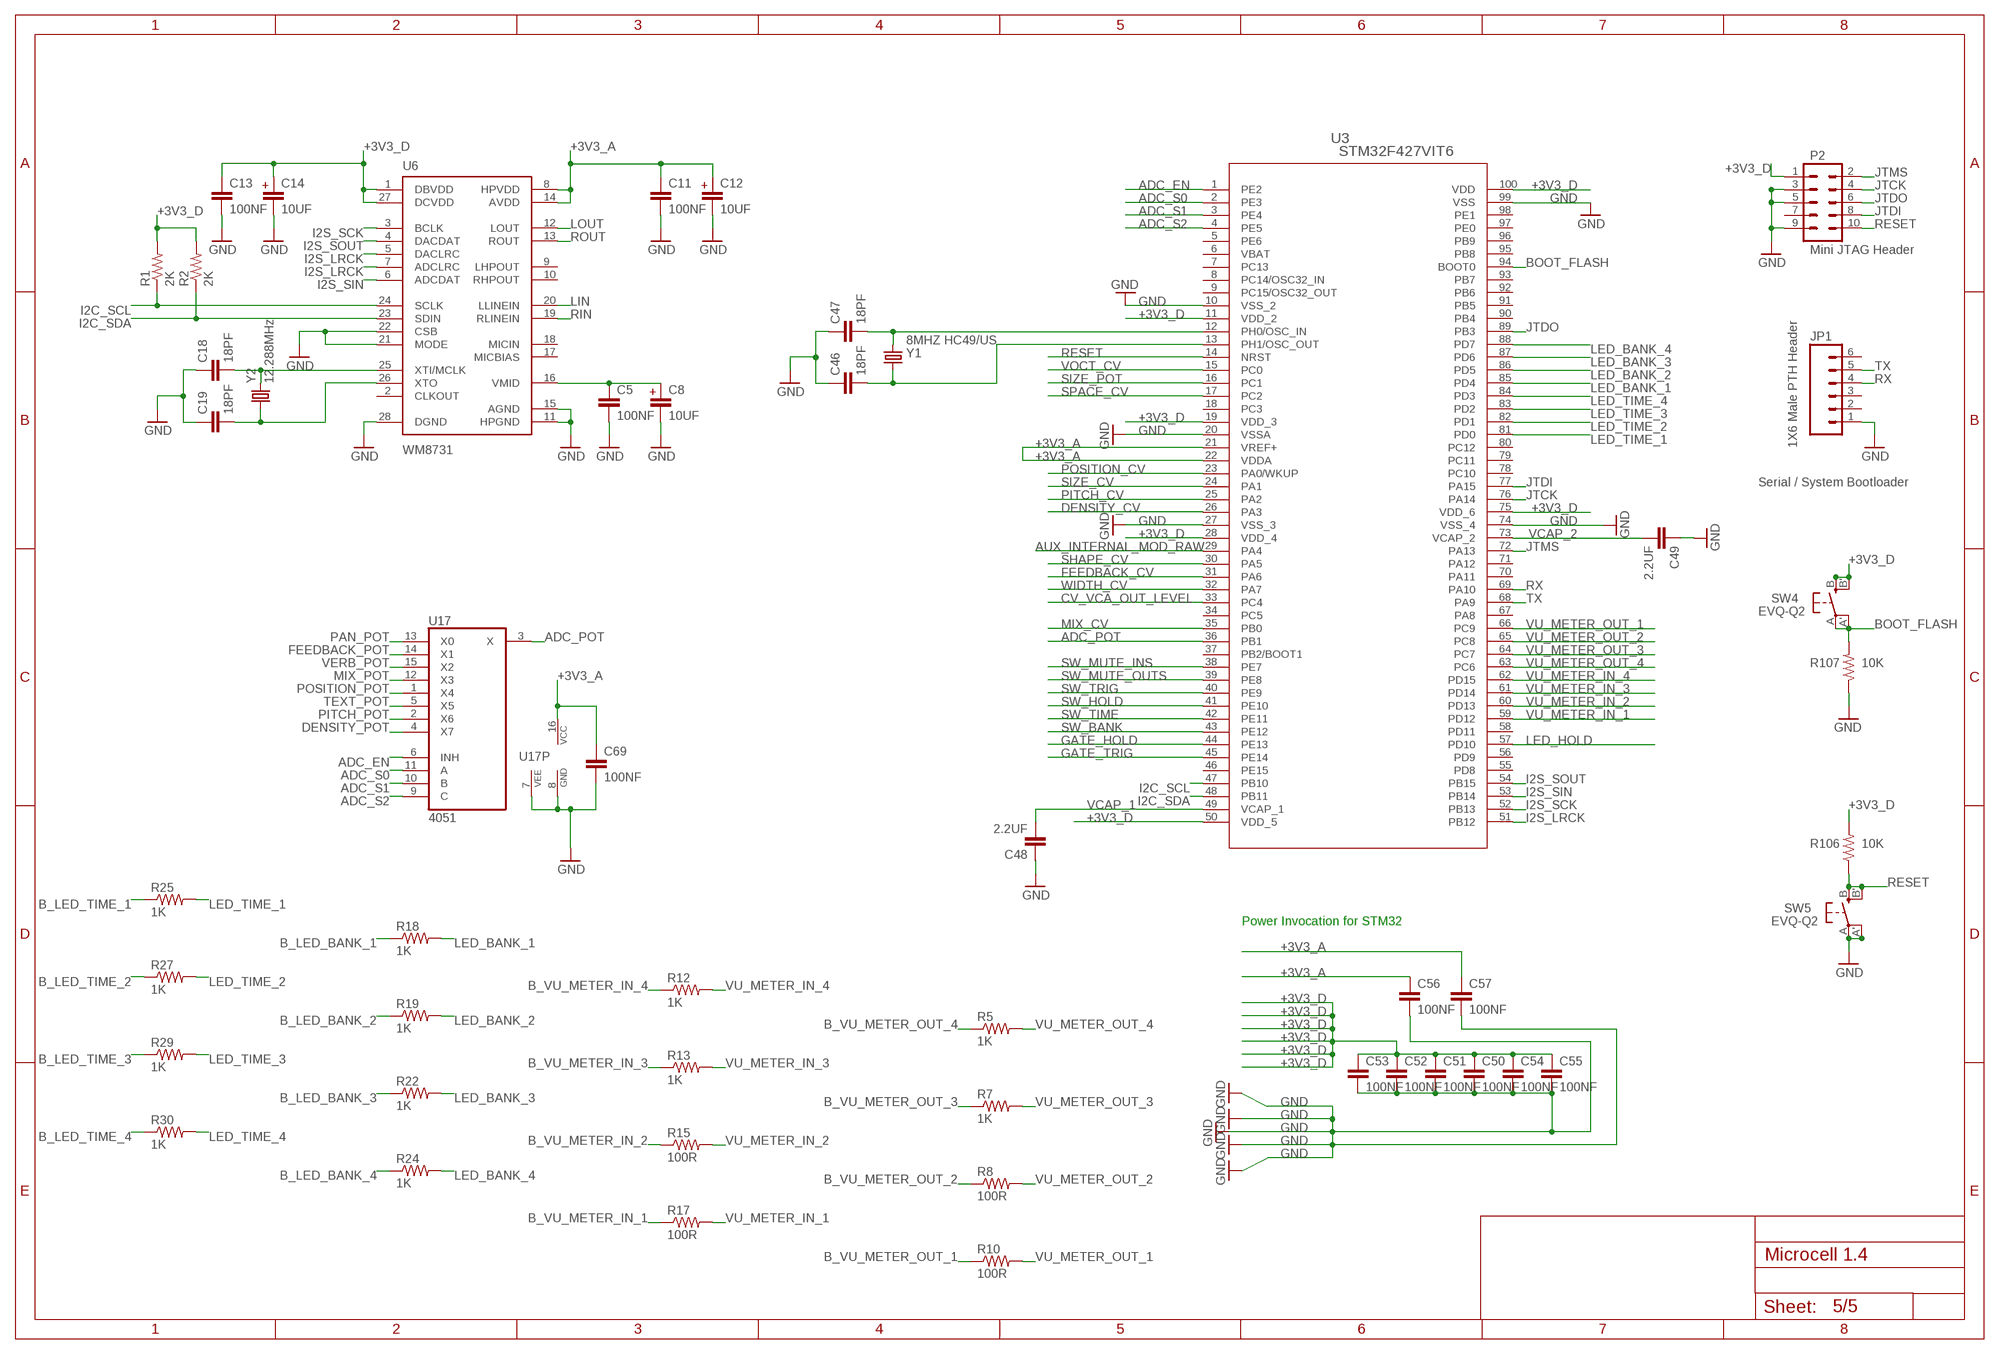
[diagram p4: schematic, sheet 5]

### Parts
C5  100NF  C-EUC0603  [C0603]
C8  10UF  C-EU-POL_4D  [EC-4X7]
C11  100NF  C-EUC0603  [C0603]
C12  10UF  C-EU-POL_4D  [EC-4X7]
C13  100NF  C-EUC0603  [C0603]
C14  10UF  C-EU-POL_4D  [EC-4X7]
C18  18PF  C-EUC0603  [C0603]
C19  18PF  C-EUC0603  [C0603]
C46  18PF  C-EUC0603  [C0603]
C47  18PF  C-EUC0603  [C0603]
C48  2.2UF  C-EUC0603  [C0603]
C49  2.2UF  C-EUC0603  [C0603]
C50  100NF  C-EUC0603  [C0603]
C51  100NF  C-EUC0603  [C0603]
C52  100NF  C-EUC0603  [C0603]
C53  100NF  C-EUC0603  [C0603]
C54  100NF  C-EUC0603  [C0603]
C55  100NF  C-EUC0603  [C0603]
C56  100NF  C-EUC0603  [C0603]
C57  100NF  C-EUC0603  [C0603]
C69  100NF  C-EUC0603  [C0603]
JP1  1X6 Male PTH Header  M06SIP  [1X06]
P2  Mini JTAG Header  M05X2MINIJTAG  [2X5-1.27]
R1  2K  R-US_R0603  [R0603]
R2  2K  R-US_R0603  [R0603]
R5  1K  R-US_R0603  [R0603]
R7  1K  R-US_R0603  [R0603]
R8  100R  R-US_R0603  [R0603]
R10  100R  R-US_R0603  [R0603]
R12  1K  R-US_R0603  [R0603]
R13  1K  R-US_R0603  [R0603]
R15  100R  R-US_R0603  [R0603]
R17  100R  R-US_R0603  [R0603]
R18  1K  R-US_R0603  [R0603]
R19  1K  R-US_R0603  [R0603]
R22  1K  R-US_R0603  [R0603]
R24  1K  R-US_R0603  [R0603]
R25  1K  R-US_R0603  [R0603]
R27  1K  R-US_R0603  [R0603]
R29  1K  R-US_R0603  [R0603]
R30  1K  R-US_R0603  [R0603]
R106  10K  R-US_R0603  [R0603]
R107  10K  R-US_R0603  [R0603]
SW4  EVQ-Q2  EVQQ2  [EVQ-Q2]
SW5  EVQ-Q2  EVQQ2  [EVQ-Q2]
U3  STM32F427VIT6  STM32F4XXV2  [LQFP100-14X14MM]
U6  WM8731  [SSOP-28]
U17  4051  4051_MUX  [SO-16]
Y1  8MHZ HC49/US  CRYSTALHC49UP  [HC49UP]
Y2  12.288MHz  CRYSTALHC49UP  [HC49UP]

### Nets
+3V3_A: C11.1 C12.P$1(POS) C56.1 C57.1 C69.1 U3.21(VREF+) U3.22(VDDA) U6.8(HPVDD) U6.14(AVDD) U17.16(VCC) ; also sheet 2,4
+3V3_D: C13.1 C14.P$1(POS) C50.1 C51.1 C52.1 C53.1 C54.1 C55.1 P2.1 R1.2 R2.2 R106.2 SW4.B'(S1) SW4.B(S) U3.11(VDD_2) U3.19(VDD_3) U3.28(VDD_4) U3.50(VDD_5) U3.75(VDD_6) U3.100(VDD) U6.1(DBVDD) U6.27(DCVDD) ; also sheet 2,4
ADC_EN: U3.1(PE2) U17.6(INH)
ADC_POT: U3.36(PB1) U17.3(X)
ADC_S0: U3.2(PE3) U17.11(A)
ADC_S1: U3.3(PE4) U17.10(B)
ADC_S2: U3.4(PE5) U17.9(C)
AUX_INTERNAL_MOD_RAW: U3.29(PA4) ; also sheet 4
B_LED_BANK_1: R18.1 ; also sheet 2
B_LED_BANK_2: R19.1 ; also sheet 2
B_LED_BANK_3: R22.1 ; also sheet 2
B_LED_BANK_4: R24.1 ; also sheet 2
B_LED_TIME_1: R25.1 ; also sheet 2
B_LED_TIME_2: R27.1 ; also sheet 2
B_LED_TIME_3: R29.1 ; also sheet 2
B_LED_TIME_4: R30.1 ; also sheet 2
B_VU_METER_IN_1: R17.1 ; also sheet 2
B_VU_METER_IN_2: R15.1 ; also sheet 2
B_VU_METER_IN_3: R13.1 ; also sheet 2
B_VU_METER_IN_4: R12.1 ; also sheet 2
B_VU_METER_OUT_1: R10.1 ; also sheet 2
B_VU_METER_OUT_2: R8.1 ; also sheet 2
B_VU_METER_OUT_3: R7.1 ; also sheet 2
B_VU_METER_OUT_4: R5.1 ; also sheet 2
BOOT_FLASH: R107.2 SW4.A'(P1) SW4.A(P) U3.94(BOOT0)
CV_VCA_OUT_LEVEL: U3.33(PC4) ; also sheet 3
DENSITY_CV: U3.26(PA3) ; also sheet 4
DENSITY_POT: U17.4(X7) ; also sheet 2
FEEDBACK_CV: U3.31(PA6) ; also sheet 4
FEEDBACK_POT: U17.14(X1) ; also sheet 2
GATE_HOLD: U3.44(PE13) ; also sheet 4
GATE_TRIG: U3.45(PE14) ; also sheet 4
GND: C5.2 C8.P$2(NEG) C11.2 C12.P$2(NEG) C13.2 C14.P$2(NEG) C18.1 C19.1 C46.1 C47.1 C48.1 C49.1 C50.2 C51.2 C52.2 C53.2 C54.2 C55.2 C56.2 C57.2 C69.2 JP1.1 P2.3 P2.5 P2.9 R107.1 SW5.A'(P1) SW5.A(P) U3.10(VSS_2) U3.20(VSSA) U3.27(VSS_3) U3.74(VSS_4) U3.99(VSS) U6.11(HPGND) U6.15(AGND) U6.21(MODE) U6.22(CSB) U6.28(DGND) U17.7(VEE) U17.8(GND) ; also sheet 2,3,4
I2C_SCL: R1.1 U3.47(PB10) U6.24(SCLK)
I2C_SDA: R2.1 U3.48(PB11) U6.23(SDIN)
I2S_LRCK: U3.51(PB12) U6.5(DACLRC) U6.7(ADCLRC)
I2S_SCK: U3.52(PB13) U6.3(BCLK)
I2S_SIN: U3.53(PB14) U6.6(ADCDAT)
I2S_SOUT: U3.54(PB15) U6.4(DACDAT)
JTCK: P2.4 U3.76(PA14)
JTDI: P2.8 U3.77(PA15)
JTDO: P2.6 U3.89(PB3)
JTMS: P2.2 U3.72(PA13)
LED_BANK_1: R18.2 U3.85(PD4)
LED_BANK_2: R19.2 U3.86(PD5)
LED_BANK_3: R22.2 U3.87(PD6)
LED_BANK_4: R24.2 U3.88(PD7)
LED_HOLD: U3.57(PD10) ; also sheet 2
LED_TIME_1: R25.2 U3.81(PD0)
LED_TIME_2: R27.2 U3.82(PD1)
LED_TIME_3: R29.2 U3.83(PD2)
LED_TIME_4: R30.2 U3.84(PD3)
LIN: U6.20(LLINEIN) ; also sheet 3
LOUT: U6.12(LOUT) ; also sheet 3
MIX_CV: U3.35(PB0) ; also sheet 4
MIX_POT: U17.12(X3) ; also sheet 2
N$4: C5.1 C8.P$1(POS) U6.16(VMID)
N$59: C19.2 U6.26(XTO) Y2.1
N$60: C18.2 U6.25(XTI/MCLK) Y2.2
N$112: C46.2 U3.13(PH1/OSC_OUT) Y1.1
N$114: C47.2 U3.12(PH0/OSC_IN) Y1.2
PAN_POT: U17.13(X0) ; also sheet 2
PITCH_CV: U3.25(PA2) ; also sheet 4
PITCH_POT: U17.2(X6) ; also sheet 2
POSITION_CV: U3.23(PA0/WKUP) ; also sheet 4
POSITION_POT: U17.1(X4) ; also sheet 2
RESET: P2.10 R106.1 SW5.B'(S1) SW5.B(S) U3.14(NRST)
RIN: U6.19(RLINEIN) ; also sheet 3
ROUT: U6.13(ROUT) ; also sheet 3
RX: JP1.4 U3.69(PA10)
SHAPE_CV: U3.30(PA5) ; also sheet 4
SIZE_CV: U3.24(PA1) ; also sheet 4
SIZE_POT: U3.16(PC1) ; also sheet 2
SPACE_CV: U3.17(PC2) ; also sheet 4
SW_BANK: U3.43(PE12) ; also sheet 2
SW_HOLD: U3.41(PE10) ; also sheet 2
SW_MUTE_INS: U3.38(PE7) ; also sheet 2
SW_MUTE_OUTS: U3.39(PE8) ; also sheet 2
SW_TIME: U3.42(PE11) ; also sheet 2
SW_TRIG: U3.40(PE9) ; also sheet 2
TEXT_POT: U17.5(X5) ; also sheet 2
TX: JP1.5 U3.68(PA9)
VCAP_1: C48.2 U3.49(VCAP_1)
VCAP_2: C49.2 U3.73(VCAP_2)
VERB_POT: U17.15(X2) ; also sheet 2
VOCT_CV: U3.15(PC0) ; also sheet 4
VU_METER_IN_1: R17.2 U3.59(PD12)
VU_METER_IN_2: R15.2 U3.60(PD13)
VU_METER_IN_3: R13.2 U3.61(PD14)
VU_METER_IN_4: R12.2 U3.62(PD15)
VU_METER_OUT_1: R10.2 U3.66(PC9)
VU_METER_OUT_2: R8.2 U3.65(PC8)
VU_METER_OUT_3: R7.2 U3.64(PC7)
VU_METER_OUT_4: R5.2 U3.63(PC6)
WIDTH_CV: U3.32(PA7) ; also sheet 4
Unconnected: JP1.2 JP1.3 JP1.6 P2.7 U3.5(PE6) U3.7(PC13) U3.8(PC14/OSC32_IN) U3.9(PC15/OSC32_OUT) U3.18(PC3) U3.34(PC5) U3.37(PB2/BOOT1) U3.46(PE15) U3.55(PD8) U3.56(PD9) U3.58(PD11) U3.67(PA8) U3.70(PA11) U3.71(PA12) U3.78(PC10) U3.79(PC11) U3.80(PC12) U3.90(PB4) U3.91(PB5) U3.92(PB6) U3.93(PB7) U3.95(PB8) U3.96(PB9) U3.97(PE0) U3.98(PE1) U6.2(CLKOUT) U6.9(LHPOUT) U6.10(RHPOUT) U6.17(MICBIAS) U6.18(MICIN)

### Notes on the sheet
- Serial / System Bootloader
- Power Invocation for STM32

## Power pins joined to a net without a drawn wire
VBAT: U3.6(VBAT)

## Library data of the parts
C1-C3 C5 C9 C11 C13 C15-C34 C36-C41 C44 C46-C59 C64-C78 C81 C82 = Electrosmith-Passives:C-EU: CAPACITOR, European symbol; PACKAGE: C0603
C4 C6 C7 C10 = Electrosmith-Passives:C-EU: CAPACITOR, European symbol; PACKAGE: C0805
C8 C12 C14 C35 C42 C43 C45 = Electrosmith-Passives:C-EU-POL
D1 D2 = Electrosmith-Semiconductors:S1B; BIN#: 12-006; IPN: S1B; MPN: S1B; PACKAGE: SMA
FB1 FB2 = Electrosmith-Passives:FERRITE_BEAD: SMD EMI Suppression Ferrite Beads - excellent anti-EMI properties - low DCR - impedances till 3000 ohms - rated current up to 6 A; BIN#: 8-047; IPN: FB R0603; MPN: MI0603J601R-10; PACKAGE: R0603
FD1-FD6 = Electrosmith-Connectors:FIDUCIAL: For use by pick and place machines to calibrate the vision/machine, 1mm By microbuilder.eu
J_AUX J_DENS J_FDBK J_HOLD J_I-LVL J_LIN J_LOUT J_MIX J_O-LVL J_PAN J_PITCH J_POSI J_RIN J_ROUT J_SIZE J_TEXT J_TRIG J_VERB J_VOCT = Electrosmith-Interface:EURO_JACK
JP1 = Electrosmith-Connectors:M06: Header 6 Standard 6-pin 0.1" header. Use with straight break away headers (SKU : PRT-00116), right angle break away headers (PRT-00553), swiss pins (PRT-00743), machine pins (PRT-00117), and female headers (PRT-00115). Molex polarized connector foot print use with SKU : PRT-08094 with associated crimp pins and housings. NOTES ON THE VARIANTS LOCK and LOCK_LONGPADS... This footprint was designed to help hold the alignment of a through-hole component (i.e. 6-pin header) while soldering it into place. You may notice that each hole has been shifted either up or down by 0.005 of an inch from it's more standard position (which is a perfectly straight line). This slight alteration caused the pins (the squares in the middle) to touch the edges of the holes. Because they are alternating, it causes a "brace" to hold the component in place. 0.005 has proven to be the perfect amount of "off-center" position when using our standard breakaway headers. Although looks a little odd when you look at the bare footprint, once you have a header in there, the alteration is very hard to notice. Also, if you push a header all the way into place, it is covered up entirely on the bottom side. This idea of altering the position of holes to aid alignment will be further integrated into the Sparkfun Library for other footprints. It can help hold any component with 3 or more connection pins.
LED_A LED_B LED_C LED_D LED_IN1-LED_IN4 LED_OUT1-LED_OUT4 LED_T1 LED_T2 LED_T4 LED_T8 = Electrosmith-Interface:LED
P1 P2 = Electrosmith-Connectors:M05X2: Header 5x2 Standard 10-pin dual row 0.1" header. Commonly used with AVR-ISP. Use with Spark Fun Electronics SKU: PRT-00778
P3-P14 = Electrosmith-Connectors:M10
Q1 Q2 = Electrosmith-Semiconductors:*-NPN-: NPN Transistror BF959 corrected 2008.03.06
R1-R46 R49-R87 R104-R107 R109-R116 = Electrosmith-Passives:R-US_: RESISTOR, American symbol; PACKAGE: R0603
S_BANK S_MUTE_INS S_MUTE_OUTS S_TIME S_TRIG = Electrosmith-Interface:TAC_SWITCH: Momentary Switch Button commonly used for reset or general input. Spark Fun Electronics SKU : COM-00097
S_HOLD = Electrosmith-Interface:LED_BUTTON
SW4 SW5 = Electrosmith-Interface:EVQQ2: SMT 6mm switch, EVQQ2 series http://www.ladyada.net/library/eagle
U1 U4 = Electrosmith-Power:LD1117; BIN#: 12-024; IPN: LD1117-3V3; MPN: LD1117S33CTR; PACKAGE: SOT-223
U2 U12 = Electrosmith-IC:TL074: OP AMP; BIN#: 16-006; IPN: TL074 SO-14; MPN: TL074CDR; PACKAGE: SO-14
U3 = Electrosmith-IC:STM32F4XXV2; IPN: empty; MANUFACTURER_PART_NUMBER: stm32f4xxv2; MPN: empty; VENDOR: STMicroelectronics
U5 U14 U15 = Electrosmith-Semiconductors:LM4041: PRECISION MICROPOWER SHUNT VOLTAGE REFERENCE Source: http://focus.ti.com/lit/ds/slcs146e/slcs146e.pdf; MPN: LM4041A12IDBZR; OC_FARNELL: 1407949; OC_NEWARK: 58K5875
U6 = Electrosmith-IC:WM8731; BIN#: 16-001; IPN: WM8731; MPN: WM8731SEDS/RV; PACKAGE: SSOP-28
U8 = Electrosmith-IC:TL072: OP AMP; BIN#: 12-015; IPN: TL072 SO-8; MPN: TL072IDT; PACKAGE: SO-8
U9-U11 = Electrosmith-IC:MCP6004; BIN#: 16-007; IPN: MCP6004 SO-14; MPN: MCP6004T-I/SL; PACKAGE: SO-14
U13 U18 = Electrosmith-IC:SSI2164; BIN#: 16-020; IPN: SSI2164 SO-16; MPN: SSI2164S-RT; PACKAGE: SO-16
U17 = Electrosmith-IC:4051_MUX: 8-channel ANALOG MULTIPLEXER
VR_DENS VR_FDBK VR_IN VR_MIX VR_OUT VR_PAN VR_PITCH VR_POSI VR_SIZE VR_TEXT VR_VERB = Electrosmith-Interface:POT_9MM_SNAP-IN_: 9mm vertical snap-in pot, Alpha / Panasonic style
Y1 Y2 = Electrosmith-Passives:CRYSTAL: CRYSTAL; OC_FARNELL: unknown; OC_NEWARK: unknown

## Net classes
0 default: width 0.203 mm
1 width: width 0.152 mm, clearance 0.152 mm